# EAGLE design eye_board (EAGLE 6.4)
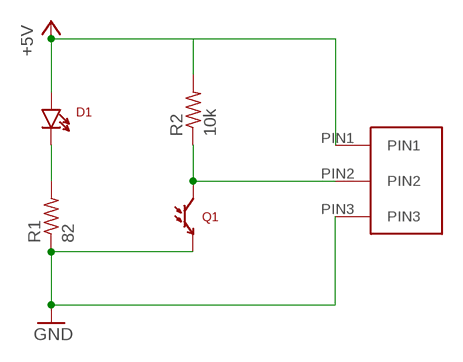
[diagram p0: schematic, sheet 1]

## Parts
3PIN_CONN  XH_JST_CONN_3POS_TOP  [XH_JST_CONN_3POS_TOP]
D1  LTE-302  [LTE-302]
Q1  LTR-301  [LTR-301]
R1  82  R-US_R0603  [R0603]
R2  10k  R-US_R0805  [R0805]

## Nets
+5V: 3PIN_CONN.PIN1 D1.A R2.2
GND: 3PIN_CONN.PIN3 Q1.E R1.1
N$1: D1.C R1.2
N$2: 3PIN_CONN.PIN2 Q1.C R2.1

## Library data of the parts
3PIN_CONN = fabule:XH_JST_CONN_3POS_TOP
D1 = SparkFun-LED:LTE-302: Through-hole side-firing 940nm IR LED
Q1 = SparkFun-Sensors:LTR-301: Through-hole side-receiving IR phototransistor
R1 R2 = rcl:R-US_: RESISTOR, American symbol

## Board
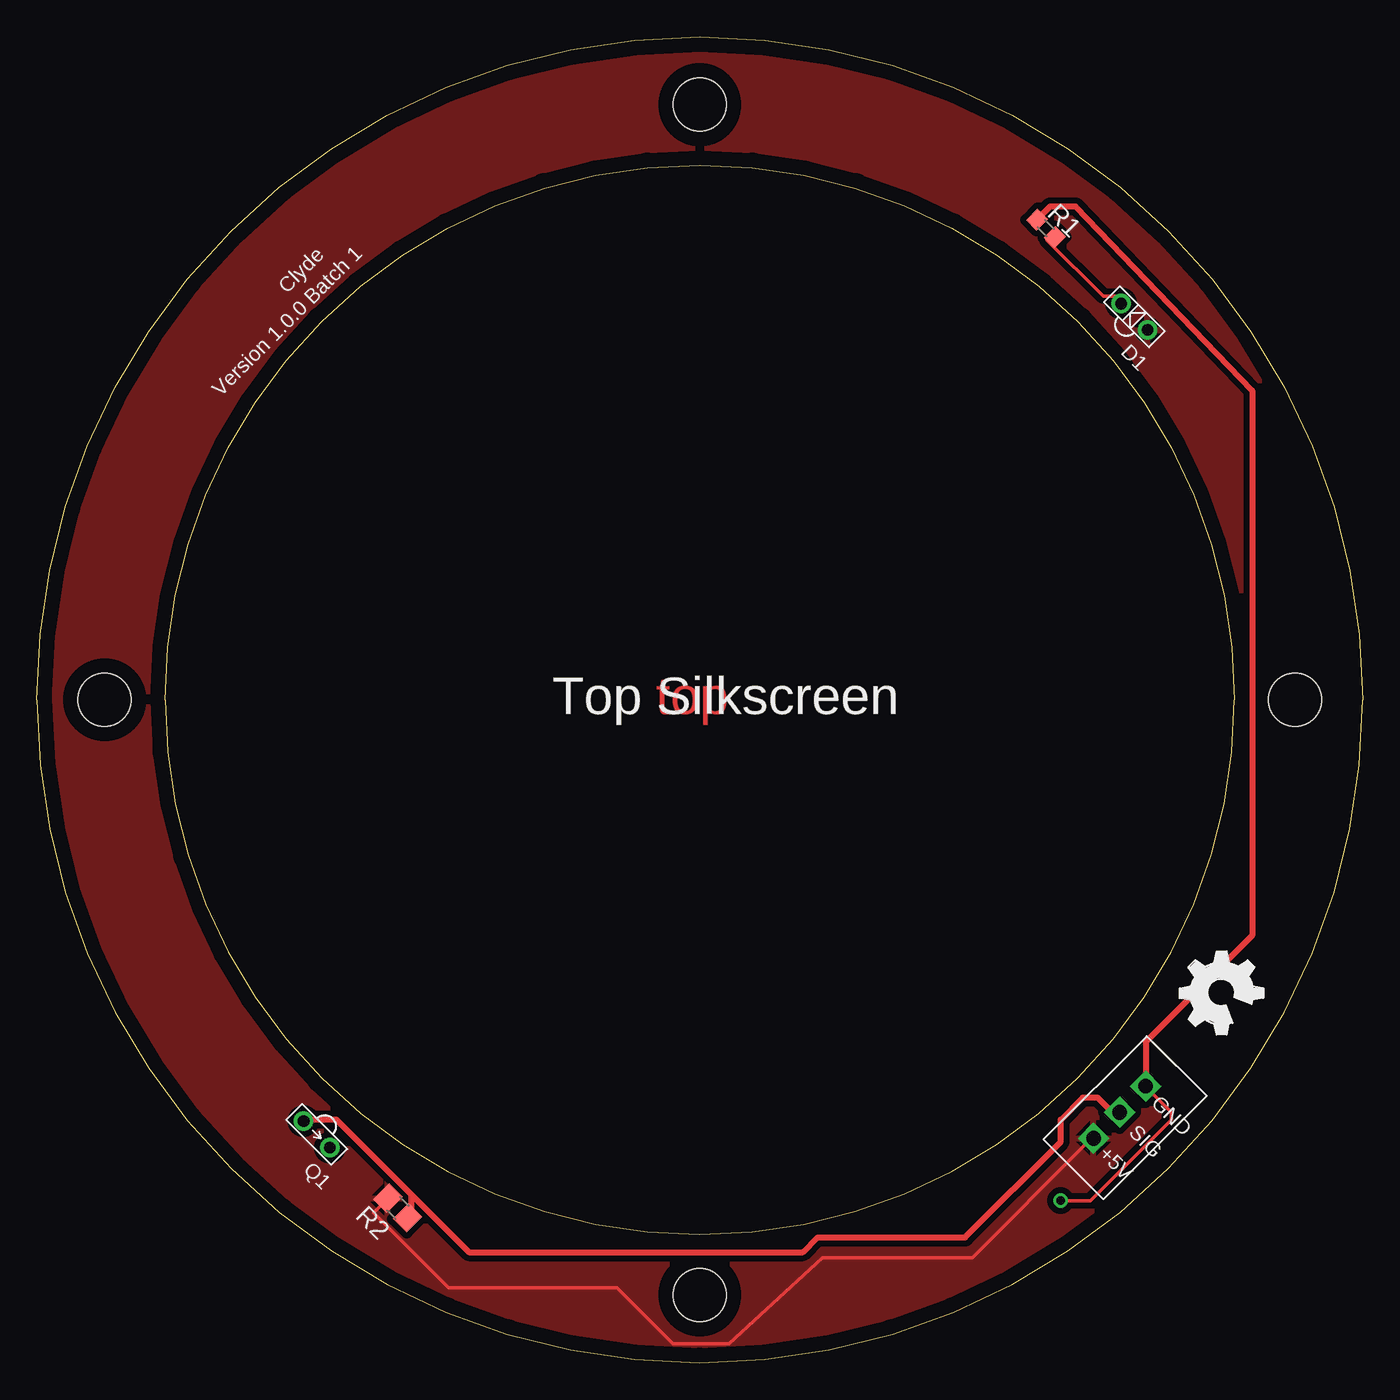
[diagram p1: board, top side]
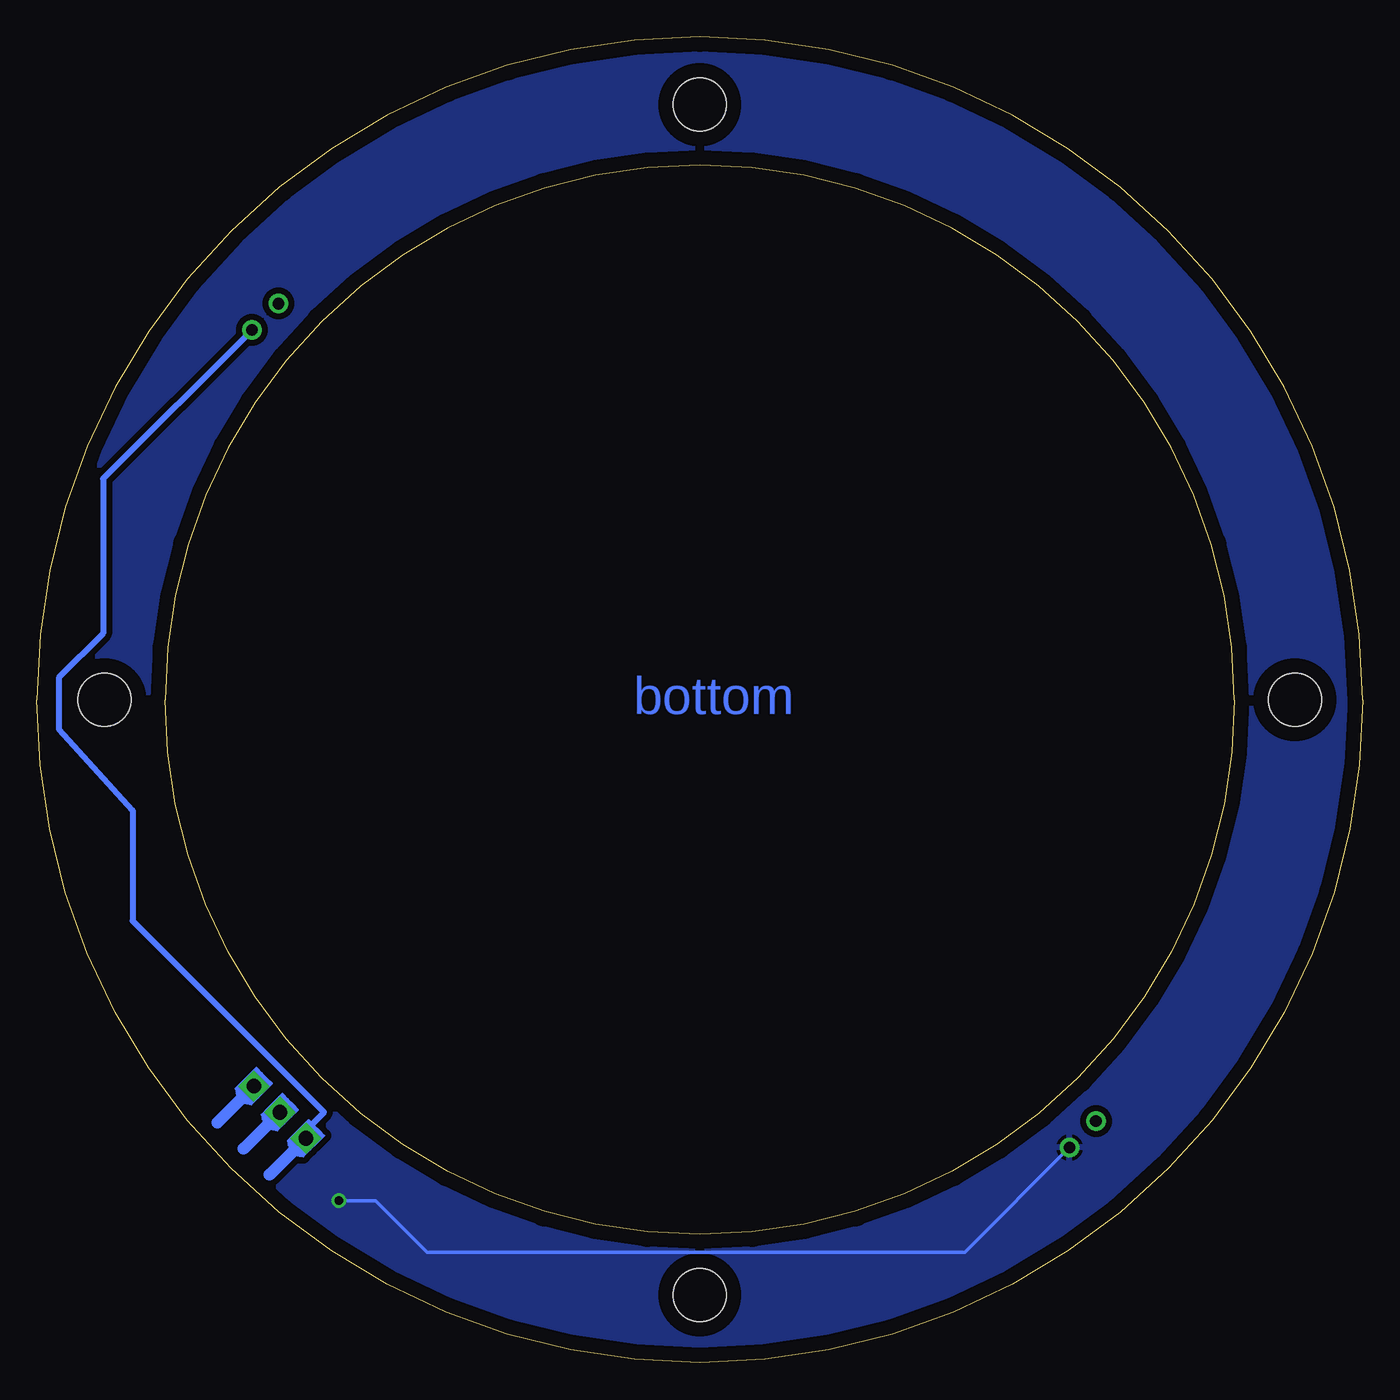
[diagram p2: board, bottom side, seen from below]

Size 90 x 90 mm. Coordinates in mm from the lower left corner, seen from the top.
Outline: 0,45 arc-180 90,45 arc-180 0,45
Outline: 8.7,45 arc-180 81.3,45 arc-180 8.7,45
Copper layers (1*16): Top 0.035mm / dielectric 1.5mm / Bottom 0.035mm
Design rules "default": minimum track width 10mil, minimum drill 24mil, track to track 8mil, track to pad 8mil, pad to pad 8mil, via to via 8mil, smd to smd 8mil, copper to edge 40mil, drill to drill 8mil, minimum pad ring 10mil, minimum via ring 8mil, stop-mask expansion 4mil, vias tented up to drill 0mil, thermal gap 10mil
Holes 3.6 mm at 45,85.4 4.6,45 85.4,45 45,4.6

### Footprints (pad centres in the part's own frame; a part is rotated, then mirrored left to right if it is on the bottom)
XH_JST_CONN_3POS_TOP = drill 1 square: PIN1 -2.5,0; PIN2 0,0; PIN3 2.5,0
LTE-302 = drill 0.8: A 1.27,0; C -1.27,0
LTR-301 = drill 0.8: C 1.27,0; E -1.27,0
R0603 = smd 1 x 1.1: 1 -0.85,0; 2 0.85,0
R0805 = smd 1.3 x 1.5: 1 -0.95,0; 2 0.95,0

### Placement (x,y rotation side)
3PIN_CONN  73.5,17 45 top
D1  74.5,71 315 top
Q1  19,15.5 135 top
R1  68.5,77 315 top
R2  24.5,10.5 135 top
U$2  [OSHW_FILLX200_NOTEXT]  80,21.5 45 top

### Tracks (layer width: path | path; a pad name or v marks a point on that pad's centre or on a via)
+5V
  Top 0.254: R2.2 24.13,11.43 22.86,10.16 27.94,5.08 39.37,5.08 43.18,1.27 46.99,1.27 53.34,7.12 63.5,7.12 71.12,14.74 3PIN_CONN.PIN1 72.39,15.24
  Bottom 0.406: D1.A 85.5,60 85.5,49.5 88.5,46.5 88.5,43 83.5,37.5 83.5,30 70.5,17 71.73,15.77 3PIN_CONN.PIN1
  pour Top (isolate 0.406): 13,79 21,85.5 32.5,89.5 45,91 63,88.5 78,77.5 86.5,64.5 91,50 90.5,37 84.5,20 74.5,9.5 62,2 49.5,-1 37,-0.5 24.5,4 11.5,12 3,24 -1,39.5 0,56 6,70
GND  (via drill 0.6)
  Top 0.254: v69.5,11 71.5,11 77,16.5 77,17 75.27,18.73 3PIN_CONN.PIN3
  Top 0.406: R1.1 68.8,78.5 70.5,78.5 82.5,66 82.5,29 75.27,21.77 3PIN_CONN.PIN3
  Bottom 0.254: Q1.E 27,7.5 63.5,7.5 67,11 v69.5,11
  pour Bottom (isolate 0.406): 38.5,91.5 59.5,90.5 73,82 86,67 91,52 90.5,36 84.5,20 74,8.5 60,1 43,-1.5 23,4 9.5,14 1.5,28 -1.5,46 2,62.5 12.5,79 21.5,86
N$1
  Top 0.254: R1.2 68.58,76.2 72.39,72.39 73.66,72.39 D1.C
N$2
  Top 0.254: 25.4,10.16 R2.1 | 17.78,16.51 Q1.C
  Top 0.406: 25.4,11.43 25.4,10.16 | 25.4,11.43 20.32,16.51 17.78,16.51 | 25.4,11.43 29.33,7.5 52,7.5 53,8.5 63,8.5 69.5,15 69.5,16.5 71,18 72,18 73,17 3PIN_CONN.PIN2

### Text on the board
Top: top
Bottom: bottom
tPlace: Clyde | D1 | Version 1.0.0 Batch 1 | Top Silkscreen | GND | SIG | Q1 | +5V
tStop: Top Solder Stop Mask
bStop: Bottom Solder Stop Mask
tCream: Top Paste Mask